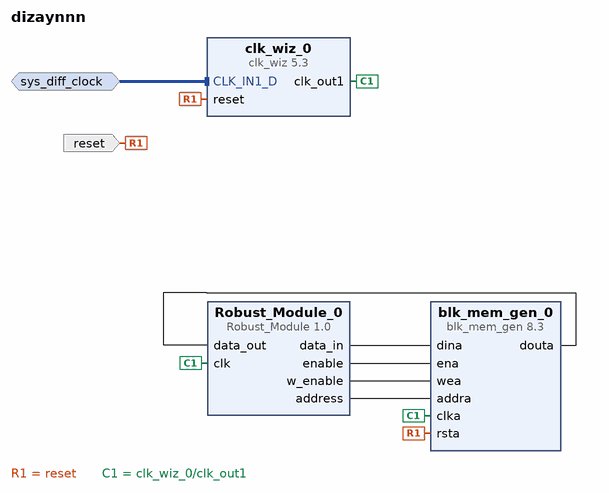
[diagram p0: block diagram of the top level]
# Vivado block design dizaynnn, xc7vx485tffg1761-2, Vivado 2016.4
create_bd_design dizaynnn

create_bd_intf_port -mode Slave -vlnv xilinx.com:interface:diff_clock_rtl:1.0 sys_diff_clock
set_property -dict {CONFIG.FREQ_HZ 200000000} [get_bd_intf_ports sys_diff_clock]
create_bd_port -dir I -type rst reset
set_property -dict {CONFIG.POLARITY ACTIVE_HIGH} [get_bd_ports reset]

create_bd_cell -type ip -vlnv xilinx.com:user:Robust_Module:1.0 Robust_Module_0
create_bd_cell -type ip -vlnv xilinx.com:ip:clk_wiz:5.3 clk_wiz_0
set_property -dict [list \
  CONFIG.USE_LOCKED false \
  CONFIG.USE_BOARD_FLOW true \
  CONFIG.CLK_IN1_BOARD_INTERFACE sys_diff_clock \
  CONFIG.RESET_BOARD_INTERFACE reset \
] [get_bd_cells clk_wiz_0]
create_bd_cell -type ip -vlnv xilinx.com:ip:blk_mem_gen:8.3 blk_mem_gen_0

# ---- connections ----

connect_bd_intf_net [get_bd_intf_ports sys_diff_clock] [get_bd_intf_pins clk_wiz_0/CLK_IN1_D]
connect_bd_net [get_bd_ports reset] [get_bd_pins clk_wiz_0/reset] [get_bd_pins blk_mem_gen_0/rsta]
connect_bd_net [get_bd_pins clk_wiz_0/clk_out1] [get_bd_pins Robust_Module_0/clk] [get_bd_pins blk_mem_gen_0/clka]
connect_bd_net [get_bd_pins blk_mem_gen_0/douta] [get_bd_pins Robust_Module_0/data_out]
connect_bd_net [get_bd_pins Robust_Module_0/data_in] [get_bd_pins blk_mem_gen_0/dina]
connect_bd_net [get_bd_pins Robust_Module_0/enable] [get_bd_pins blk_mem_gen_0/ena]
connect_bd_net [get_bd_pins Robust_Module_0/w_enable] [get_bd_pins blk_mem_gen_0/wea]
connect_bd_net [get_bd_pins Robust_Module_0/address] [get_bd_pins blk_mem_gen_0/addra]

validate_bd_design
save_bd_design
